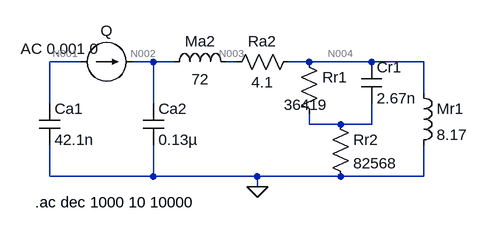
[diagram p0: schematic EA_DuplaCaixaDutada.asc]
EA_DuplaCaixaDutada.asc, the LTspice schematic file:
Version 4
SHEET 1 880 680
WIRE -32 64 -80 64
WIRE 80 64 48 64
WIRE 112 64 80 64
WIRE 208 64 192 64
WIRE 320 64 288 64
WIRE 416 64 320 64
WIRE 496 64 416 64
WIRE 496 112 496 64
WIRE -80 128 -80 64
WIRE 80 128 80 64
WIRE 320 160 320 144
WIRE 368 160 320 160
WIRE 416 160 416 128
WIRE 416 160 368 160
WIRE -80 240 -80 192
WIRE 80 240 80 192
WIRE 80 240 -80 240
WIRE 240 240 80 240
WIRE 368 240 240 240
WIRE 496 240 496 192
WIRE 496 240 368 240
WIRE 240 256 240 240
FLAG 240 256 0
SYMBOL cap -96 128 R0
SYMATTR InstName Ca1
SYMATTR Value 42.1n
SYMBOL cap 64 128 R0
SYMATTR InstName Ca2
SYMATTR Value 0.13µ
SYMBOL ind 96 80 R270
WINDOW 0 32 56 VTop 2
WINDOW 3 5 56 VBottom 2
SYMATTR InstName Ma2
SYMATTR Value 72
SYMBOL res 304 48 R90
WINDOW 0 0 56 VBottom 2
WINDOW 3 32 56 VTop 2
SYMATTR InstName Ra2
SYMATTR Value 4.1
SYMBOL res 304 48 R0
WINDOW 3 -23 82 Left 2
SYMATTR Value 36419
SYMATTR InstName Rr1
SYMBOL res 352 144 R0
SYMATTR InstName Rr2
SYMATTR Value 82568
SYMBOL cap 400 64 R0
SYMATTR InstName Cr1
SYMATTR Value 2.67n
SYMBOL ind 480 96 R0
SYMATTR InstName Mr1
SYMATTR Value 8.17
SYMBOL current -32 64 R270
WINDOW 0 32 40 VTop 2
WINDOW 3 -32 40 VBottom 2
WINDOW 123 36 -32 VBottom 2
WINDOW 39 0 0 Left 0
SYMATTR InstName Q
SYMATTR Value ""
SYMATTR Value2 AC 0.001 0
TEXT -102 280 Left 2 !.ac dec 1000 10 10000

The netlist it stands for:
* EA_DuplaCaixaDutada.asc
Ca1 N001 0 42.1n
Ca2 N002 0 0.13µ
L§Ma2 N002 N003 72
Ra2 N004 N003 4.1
Rr1 N004 N005 36419
Rr2 N005 0 82568
Cr1 N004 N005 2.67n
L§Mr1 N004 0 8.17
I§Q N001 N002 AC 0.001 0
.ac dec 1000 10 10000
.backanno
.end

* Results of the author's LTspice run, read from the files saved beside the schematic
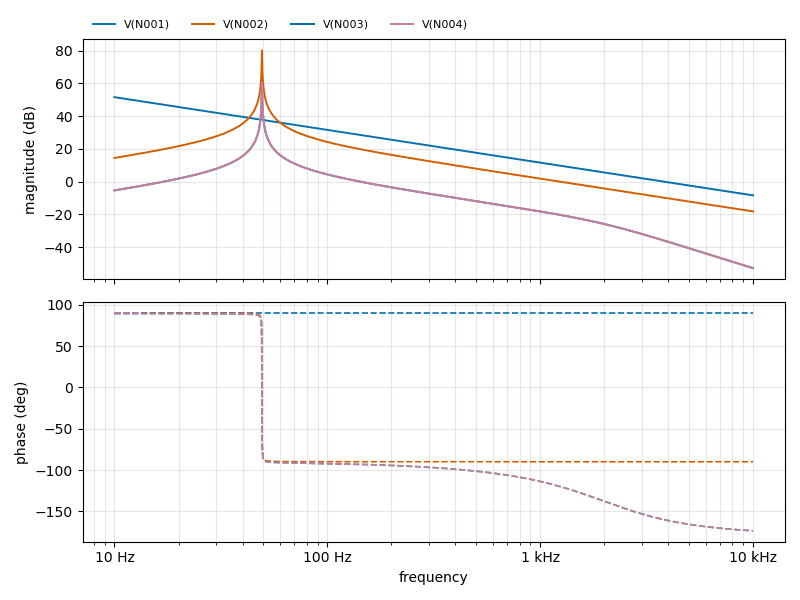
[diagram p1: AC Analysis of EA_DuplaCaixaDutada.asc, plotted from the saved traces]
* AC Analysis, 1 run:
*   V(N001): 51.55 dB at 10 Hz, -8.45 dB at 10 kHz, peak 51.55 dB at 10 Hz, 3 dB below the peak at 14.14 Hz
*   V(N002): 14.41 dB at 10 Hz, -18.24 dB at 10 kHz, peak 80.16 dB at 49.32 Hz, 3 dB below the peak at 49.25 Hz and 49.36 Hz
*   V(N003): -5.43 dB at 10 Hz, -52.93 dB at 10 kHz, peak 60.33 dB at 49.32 Hz, 3 dB below the peak at 49.25 Hz and 49.36 Hz
*   V(N004): -5.43 dB at 10 Hz, -52.93 dB at 10 kHz, peak 60.33 dB at 49.32 Hz, 3 dB below the peak at 49.25 Hz and 49.36 Hz